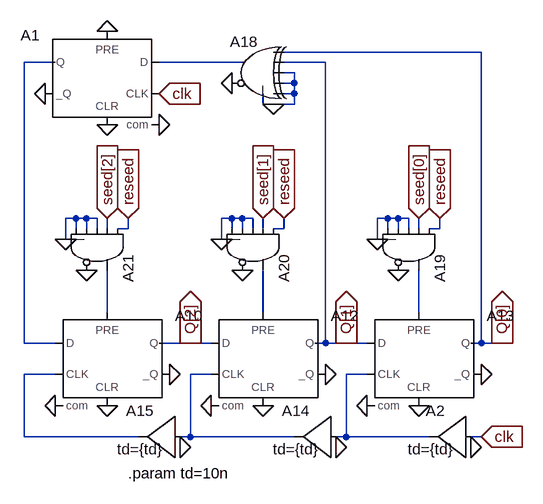
[diagram p0: schematic lfsr_3bit.asc]
lfsr_3bit.asc, the LTspice schematic file:
Version 4
SHEET 1 2204 680
WIRE 1920 -352 1616 -352
WIRE 1264 -336 1216 -336
WIRE 1552 -336 1424 -336
WIRE 1680 -336 1616 -336
WIRE 1632 -320 1616 -320
WIRE 1632 -304 1632 -320
WIRE 1632 -304 1616 -304
WIRE 1632 -288 1632 -304
WIRE 1632 -288 1616 -288
WIRE 1584 -272 1584 -288
WIRE 1600 -272 1584 -272
WIRE 1632 -272 1632 -288
WIRE 1632 -272 1600 -272
WIRE 1296 -96 1280 -96
WIRE 1312 -96 1296 -96
WIRE 1328 -96 1312 -96
WIRE 1536 -96 1520 -96
WIRE 1552 -96 1536 -96
WIRE 1568 -96 1552 -96
WIRE 1776 -96 1760 -96
WIRE 1792 -96 1776 -96
WIRE 1808 -96 1792 -96
WIRE 1296 -80 1296 -96
WIRE 1312 -80 1312 -96
WIRE 1328 -80 1328 -96
WIRE 1344 -80 1344 -96
WIRE 1376 -80 1376 -96
WIRE 1376 -80 1360 -80
WIRE 1536 -80 1536 -96
WIRE 1552 -80 1552 -96
WIRE 1568 -80 1568 -96
WIRE 1584 -80 1584 -96
WIRE 1616 -80 1616 -96
WIRE 1616 -80 1600 -80
WIRE 1776 -80 1776 -96
WIRE 1792 -80 1792 -96
WIRE 1808 -80 1808 -96
WIRE 1824 -80 1824 -96
WIRE 1856 -80 1856 -96
WIRE 1856 -80 1840 -80
WIRE 1280 -64 1280 -96
WIRE 1296 -64 1280 -64
WIRE 1520 -64 1520 -96
WIRE 1536 -64 1520 -64
WIRE 1760 -64 1760 -96
WIRE 1776 -64 1760 -64
WIRE 1344 48 1344 -16
WIRE 1584 48 1584 -16
WIRE 1824 48 1824 -16
WIRE 1216 96 1216 -336
WIRE 1264 96 1216 96
WIRE 1472 96 1424 96
WIRE 1504 96 1472 96
WIRE 1680 96 1680 -336
WIRE 1680 96 1664 96
WIRE 1712 96 1680 96
WIRE 1744 96 1712 96
WIRE 1920 96 1920 -352
WIRE 1920 96 1904 96
WIRE 1952 96 1920 96
WIRE 1968 96 1952 96
WIRE 1264 144 1216 144
WIRE 1504 144 1472 144
WIRE 1744 144 1712 144
WIRE 1216 240 1216 144
WIRE 1392 240 1216 240
WIRE 1472 240 1472 144
WIRE 1472 240 1456 240
WIRE 1632 240 1472 240
WIRE 1712 240 1712 144
WIRE 1712 240 1696 240
WIRE 1840 240 1712 240
WIRE 1920 240 1904 240
FLAG 1440 144 0
FLAG 1264 192 0
FLAG 1344 192 0
FLAG 1680 144 0
FLAG 1744 192 0
FLAG 1504 192 0
FLAG 1584 192 0
FLAG 1824 192 0
FLAG 1696 256 0
FLAG 1712 96 Q[1]
IOPIN 1712 96 Out
FLAG 1456 256 0
FLAG 1472 96 Q[2]
IOPIN 1472 96 Out
FLAG 1920 144 0
FLAG 1952 96 Q[0]
IOPIN 1952 96 Out
FLAG 1920 240 clk
IOPIN 1920 240 In
FLAG 1600 -272 0
FLAG 1536 -304 0
FLAG 1824 -96 seed[0]
IOPIN 1824 -96 In
FLAG 1584 -96 seed[1]
IOPIN 1584 -96 In
FLAG 1344 -96 seed[2]
IOPIN 1344 -96 In
FLAG 1792 -16 0
FLAG 1760 -64 0
FLAG 1856 -96 reseed
IOPIN 1856 -96 In
FLAG 1552 -16 0
FLAG 1520 -64 0
FLAG 1616 -96 reseed
IOPIN 1616 -96 In
FLAG 1312 -16 0
FLAG 1280 -64 0
FLAG 1376 -96 reseed
IOPIN 1376 -96 In
FLAG 1248 -288 0
FLAG 1424 -240 0
FLAG 1344 -240 0
FLAG 1344 -384 0
FLAG 1424 -288 clk
IOPIN 1424 -288 In
FLAG 1904 256 0
SYMBOL Digital\\dflop 1344 48 R0
SYMATTR InstName A10
SYMBOL Digital\\dflop 1584 48 R0
SYMATTR InstName A12
SYMBOL Digital\\dflop 1824 48 R0
SYMATTR InstName A13
SYMBOL Digital\\buf1 1696 176 M0
WINDOW 3 26 83 Left 2
SYMATTR Value td={td}
SYMATTR InstName A14
SYMBOL Digital\\buf1 1456 176 M0
WINDOW 3 26 83 Left 2
SYMATTR Value td={td}
SYMATTR InstName A15
SYMBOL Digital\\xor 1568 -384 M0
SYMATTR InstName A18
SYMBOL Digital\\and 1872 -48 R90
SYMATTR InstName A19
SYMBOL Digital\\and 1632 -48 R90
SYMATTR InstName A20
SYMBOL Digital\\and 1392 -48 R90
SYMATTR InstName A21
SYMBOL Digital\\dflop 1344 -384 M0
SYMATTR InstName A1
SYMBOL Digital\\buf1 1904 176 M0
WINDOW 3 26 83 Left 2
SYMATTR Value td={td}
SYMATTR InstName A2
TEXT 1376 296 Left 2 !.param td=10n

The netlist it stands for:
* lfsr_3bit.asc
A10 N001 0 N006 N003 0 0 Q[2] 0 DFLOP
A12 Q[2] 0 N007 N004 0 0 Q[1] 0 DFLOP
A13 Q[1] 0 N008 N005 0 0 Q[0] 0 DFLOP
A14 N008 0 0 0 0 0 N007 0 BUF td={td}
A15 N007 0 0 0 0 0 N006 0 BUF td={td}
A18 Q[0] Q[1] 0 0 0 0 N002 0 XOR
A19 reseed seed[0] 0 0 0 0 N005 0 AND
A20 reseed seed[1] 0 0 0 0 N004 0 AND
A21 reseed seed[2] 0 0 0 0 N003 0 AND
A1 N002 0 clk 0 0 0 N001 0 DFLOP
A2 clk 0 0 0 0 0 N008 0 BUF td={td}
.param td=10n
.backanno
.end